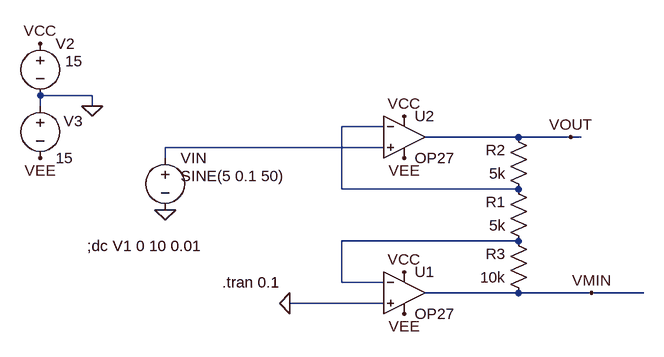
[diagram p0: schematic Draft22.asc]
Draft22.asc, the LTspice schematic file:
Version 4
SHEET 1 904 680
WIRE -64 32 -144 32
WIRE -144 48 -144 32
WIRE -64 48 -64 32
WIRE 384 80 320 80
WIRE 592 96 448 96
WIRE 672 96 592 96
WIRE 688 96 672 96
WIRE 384 112 48 112
WIRE 48 128 48 112
WIRE 320 176 320 80
WIRE 592 176 320 176
WIRE 592 256 320 256
WIRE 320 320 320 256
WIRE 384 320 320 320
WIRE 592 336 448 336
WIRE 704 336 592 336
WIRE 784 336 704 336
WIRE 384 352 240 352
FLAG 48 208 0
FLAG -64 48 0
FLAG 672 96 VOUT
FLAG -144 -48 VCC
FLAG 416 64 VCC
FLAG -144 128 VEE
FLAG 416 128 VEE
FLAG 416 304 VCC
FLAG 416 368 VEE
FLAG 704 336 VMIN
FLAG 240 352 0
SYMBOL voltage 48 112 R0
WINDOW 123 0 0 Left 0
WINDOW 39 0 0 Left 0
WINDOW 3 24 44 Left 2
SYMATTR Value SINE(5 0.1 50)
SYMATTR InstName VIN
SYMBOL voltage -144 -64 R0
WINDOW 123 0 0 Left 0
WINDOW 39 0 0 Left 0
WINDOW 3 38 43 Left 2
SYMATTR Value 15
SYMATTR InstName V2
SYMBOL voltage -144 32 R0
WINDOW 123 0 0 Left 0
WINDOW 39 0 0 Left 0
WINDOW 0 36 39 Left 2
SYMATTR InstName V3
SYMATTR Value 15
SYMBOL res 608 192 R180
WINDOW 0 36 76 Left 2
WINDOW 3 36 40 Left 2
SYMATTR InstName R2
SYMATTR Value 5k
SYMBOL res 608 352 R180
WINDOW 0 36 76 Left 2
WINDOW 3 36 40 Left 2
SYMATTR InstName R3
SYMATTR Value 10k
SYMBOL OpAmps\\OP27 416 32 R0
SYMATTR InstName U2
SYMBOL OpAmps\\OP27 416 272 R0
SYMATTR InstName U1
SYMBOL res 608 272 R180
WINDOW 0 36 76 Left 2
WINDOW 3 36 40 Left 2
SYMATTR InstName R1
SYMATTR Value 5k
TEXT -72 264 Left 2 !;dc V1 0 10 0.01
TEXT 136 320 Left 2 !.tran 0.1

The netlist it stands for:
* Draft22.asc
VIN N002 0 SINE(5 0.1 50)
V2 VCC 0 15
V3 0 VEE 15
R2 N001 VOUT 5k
R3 VMIN N003 10k
XU2 N002 N001 VCC VEE VOUT OP27  ; pins In+ In- V+ V- OUT
XU1 0 N003 VCC VEE VMIN OP27  ; pins In+ In- V+ V- OUT
R1 N003 N001 5k
;dc V1 0 10 0.01
.tran 0.1
.lib ADI.lib
.backanno
.end